# EAGLE schematic osi-proto (EAGLE 6.3)
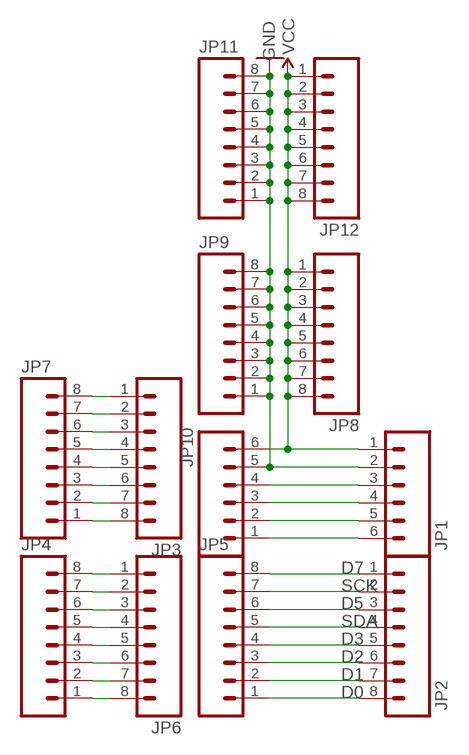
[diagram p0: schematic, sheet 1]

## Parts
JP1  M06SIP  [1X06]
JP2  M081X08  [1X08]
JP3  M081X08  [1X08]
JP4  M081X08  [1X08]
JP5  M081X08  [1X08]
JP6  M081X08  [1X08]
JP7  M081X08  [1X08]
JP8  M081X08  [1X08]
JP9  M081X08  [1X08]
JP10  M06SIP  [1X06]
JP11  M081X08  [1X08]
JP12  M081X08  [1X08]

## Nets
D0: JP2.8 JP5.1
D1: JP2.7 JP5.2
D2: JP2.6 JP5.3
D3: JP2.5 JP5.4
D5: JP2.3 JP5.6
D7: JP2.1 JP5.8
GND: JP1.2 JP9.1 JP9.2 JP9.3 JP9.4 JP9.5 JP9.6 JP9.7 JP9.8 JP10.5 JP11.1 JP11.2 JP11.3 JP11.4 JP11.5 JP11.6 JP11.7 JP11.8
N$1: JP4.8 JP6.1
N$2: JP4.7 JP6.2
N$3: JP4.6 JP6.3
N$4: JP4.5 JP6.4
N$5: JP4.4 JP6.5
N$6: JP4.3 JP6.6
N$7: JP4.2 JP6.7
N$8: JP4.1 JP6.8
N$9: JP3.1 JP7.8
N$10: JP3.2 JP7.7
N$11: JP3.3 JP7.6
N$12: JP3.4 JP7.5
N$13: JP3.5 JP7.4
N$14: JP3.6 JP7.3
N$15: JP3.7 JP7.2
N$16: JP3.8 JP7.1
N$18: JP1.6 JP10.1
N$20: JP1.5 JP10.2
N$21: JP1.4 JP10.3
N$22: JP1.3 JP10.4
SCK: JP2.2 JP5.7
SDA: JP2.4 JP5.5
VCC: JP1.1 JP8.1 JP8.2 JP8.3 JP8.4 JP8.5 JP8.6 JP8.7 JP8.8 JP10.6 JP12.1 JP12.2 JP12.3 JP12.4 JP12.5 JP12.6 JP12.7 JP12.8

## Library data of the parts
JP1 JP10 = SparkFun_mod:M06: Header 6 Standard 6-pin 0.1" header. Use with straight break away headers (SKU : PRT-00116), right angle break away headers (PRT-00553), swiss pins (PRT-00743), machine pins (PRT-00117), and female headers (PRT-00115). Molex polarized connector foot print use with SKU : PRT-08094 with associated crimp pins and housings. NOTES ON THE VARIANTS LOCK and LOCK_LONGPADS... This footprint was designed to help hold the alignment of a through-hole component (i.e. 6-pin header) while soldering it into place. You may notice that each hole has been shifted either up or down by 0.005 of an inch from it's more standard position (which is a perfectly straight line). This slight alteration caused the pins (the squares in the middle) to touch the edges of the holes. Because they are alternating, it causes a "brace" to hold the component in place. 0.005 has proven to be the perfect amount of "off-center" position when using our standard breakaway headers. Although looks a little odd when you look at the bare footprint, once you have a header in there, the alteration is very hard to notice. Also, if you push a header all the way into place, it is covered up entirely on the bottom side. This idea of altering the position of holes to aid alignment will be further integrated into the Sparkfun Library for other footprints. It can help hold any component with 3 or more connection pins.
JP2-JP9 JP11 JP12 = SparkFun_mod:M08: Header 8 Standard 8-pin 0.1" header. Use with straight break away headers (SKU : PRT-00116), right angle break away headers (PRT-00553), swiss pins (PRT-00743), machine pins (PRT-00117), and female headers (PRT-00115).